# Altium project Smart Dimmer.PrjPcb
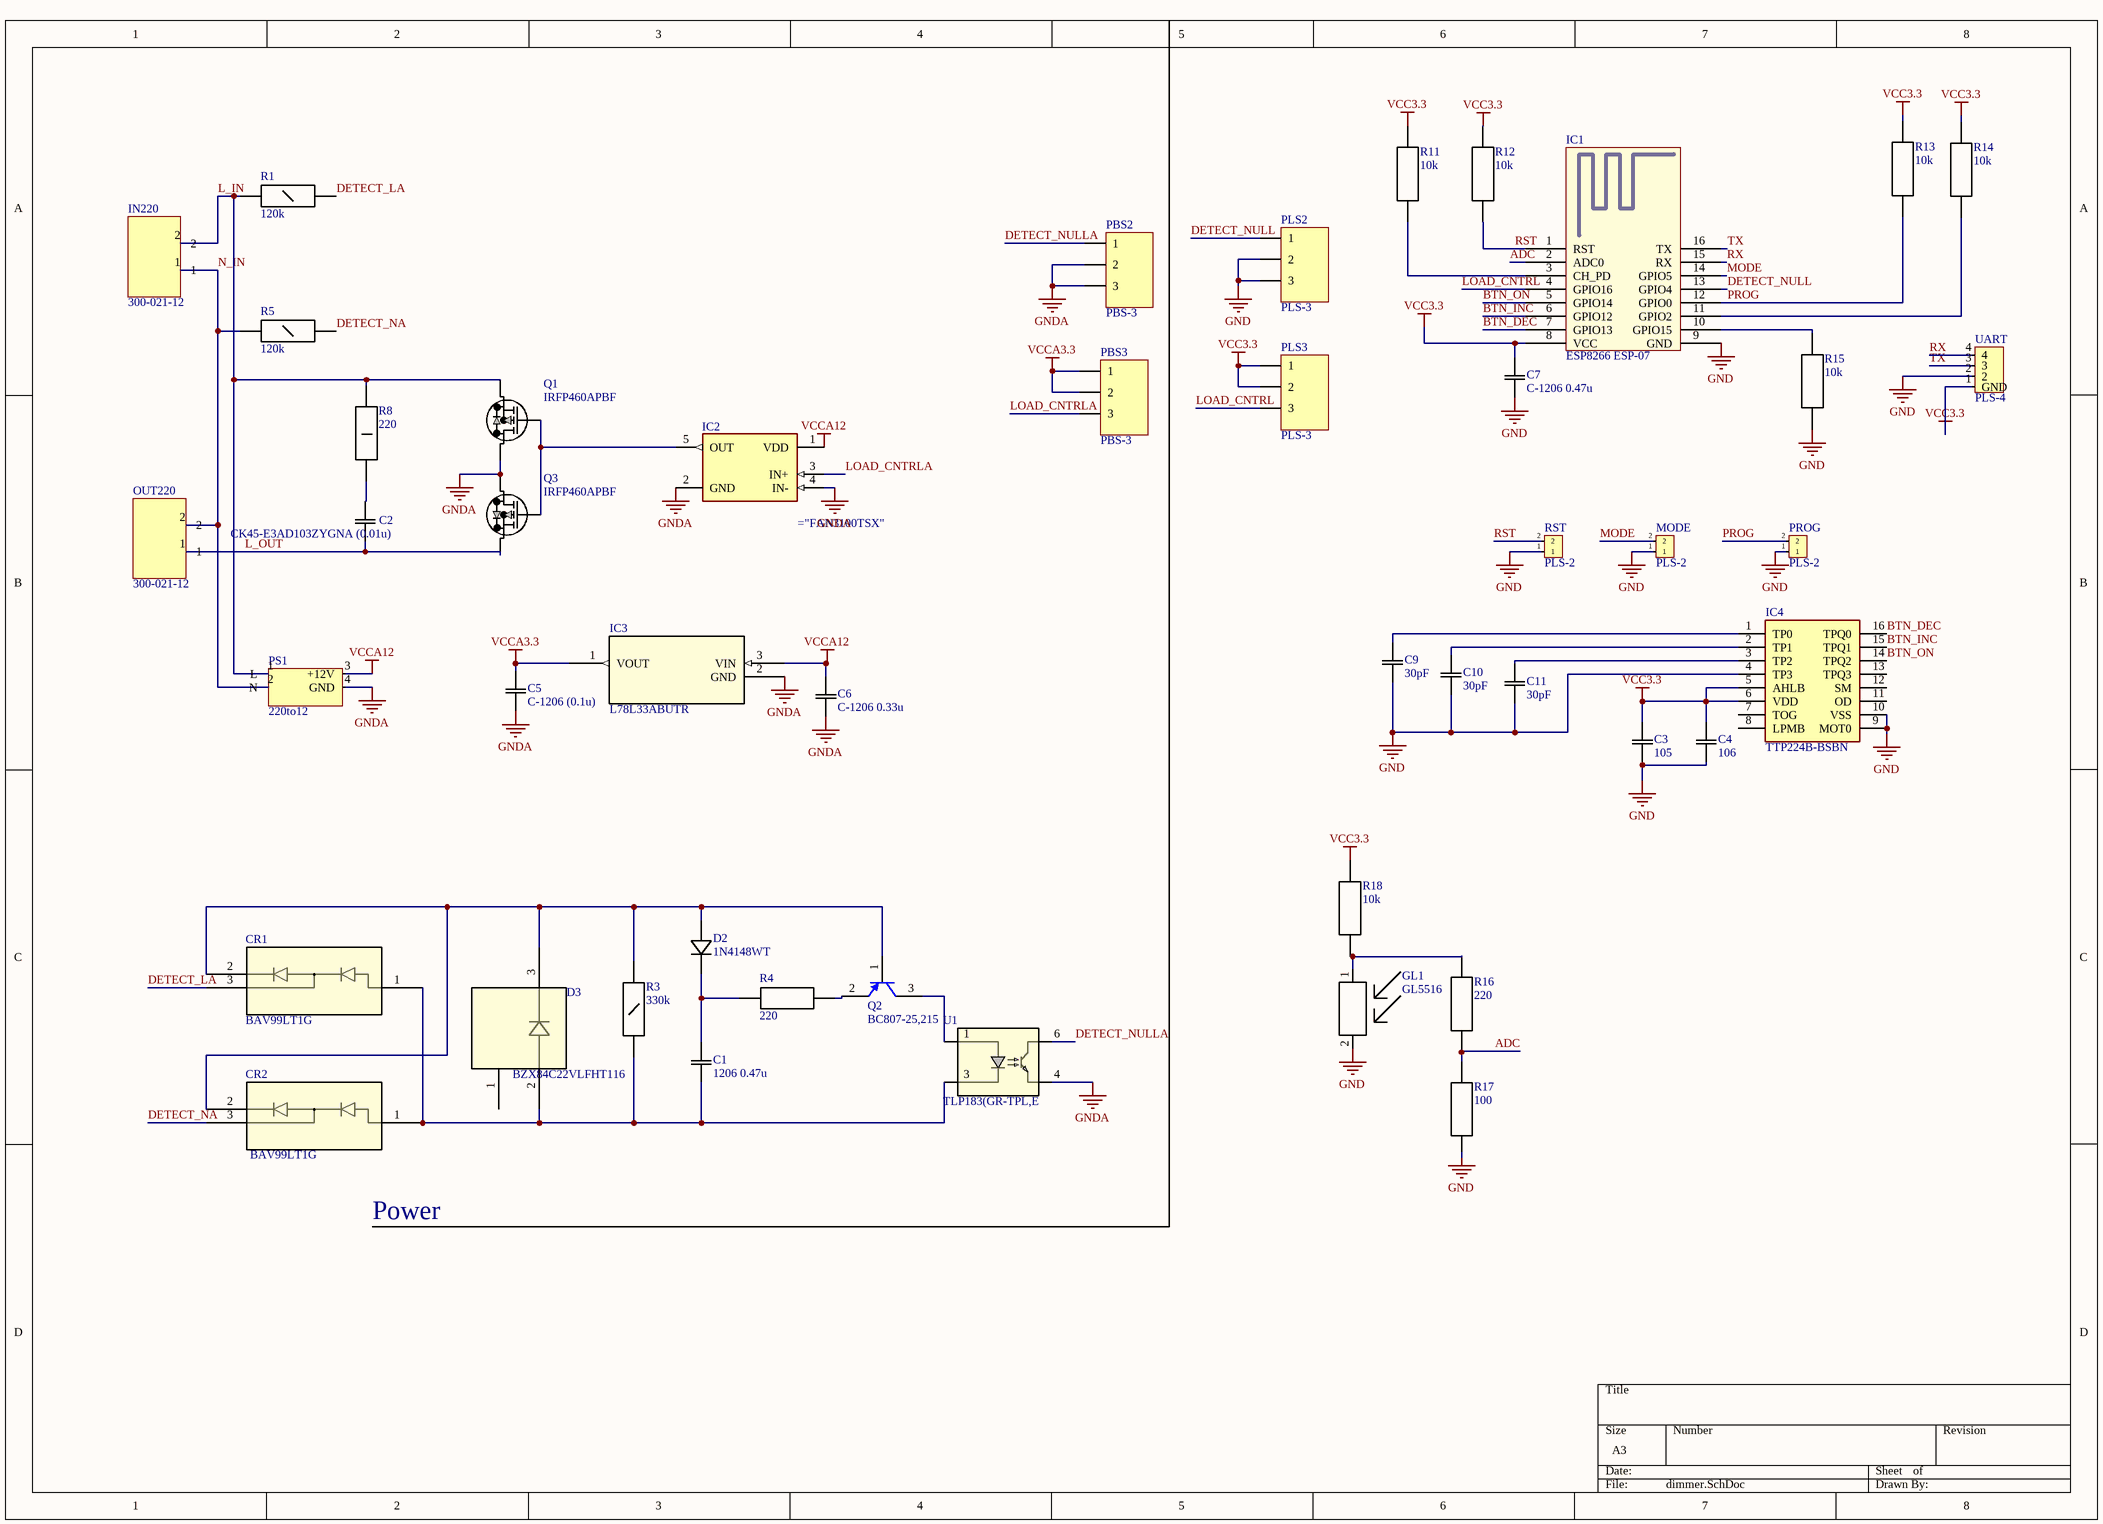
[diagram p0: dimmer.SchDoc]
1 sheet, 47 parts. Net scope: global (net labels, ports and power ports of the same name join across sheets).
Board files: PCB12_sensor.PcbDoc, PCB9.PcbDoc, PCB5.PcbDoc, PCB11_sensor.PcbDoc

## Sheet dimmer.SchDoc
size A3

### Parts
C1  1206 0.47u  [CAP_X7R_1206_AVX]
C2  CK45-E3AD103ZYGNA (0.01u)  [CAP_CK45E3103_TDK]
C3  105  [G-21_MUR]
C4  106  [G-21_MUR]
C5  C-1206 (0.1u)  [CAP_X7R_1206_AVX]
C6  C-1206 0.33u  [CAP_X7R_1206_AVX]
C7  C-1206 0.47u  [CAP_X7R_1206_AVX]
C9  30pF  [G-21_MUR]
C10  30pF  [G-21_MUR]
C11  30pF  [G-21_MUR]
CR1  BAV99LT1G  [SOT-23_TO-236_318-08_ONS]
CR2  BAV99LT1G  [SOT-23_TO-236_318-08_ONS]
D2  1N4148WT  [CR_SOD-523F_ONS]
D3  BZX84C22VLFHT116  [TRANS_BZX84_ROM]
GL1  GL5516  [GL5516]
IC1  ESP8266 ESP-07  [ESP8266 ESP-07]
IC2  FAN3100TSX  [ON_Semi_527AH_0]  (value not drawn)
IC3  L78L33ABUTR  [SOT-89_STM]
IC4  TTP224B-BSBN  [SOP64P600X175-16N]
IN220  300-021-12  [300-021-12]
MODE  PLS-2  [PLS-2]
OUT220  300-021-12  [300-021-12]
PBS2  PBS-3  [PBS-3]
PBS3  PBS-3  [PBS-3]
PLS2  PLS-3  [PLS-3]
PLS3  PLS-3  [PLS-3]
PROG  PLS-2  [PLS-2]
PS1  220to12  [220to12]
Q1  IRFP460APBF  [TO-247AC_VIS]
Q2  BC807-25,215  [SOT23_BC807_NEX]
Q3  IRFP460APBF  [TO-247AC_VIS]
R1  120k  [CAP_X7R_1206_AVX]
R3  330k  [CAP_X7R_1206_AVX]
R4  220  [G-21_MUR]
R5  120k  [CAP_X7R_1206_AVX]
R8  220  [RES2512_TL_TYCO_TYC]
R11  10k  [G-21_MUR]
R12  10k  [G-21_MUR]
R13  10k  [G-21_MUR]
R14  10k  [G-21_MUR]
R15  10k  [G-21_MUR]
R16  220  [G-21_MUR]
R17  100  [G-21_MUR]
R18  10k  [G-21_MUR]
RST  PLS-2  [PLS-2]
U1  TLP183(GR-TPL,E  [4pin SO6_TOS]
UART  PLS-4  [PLS-4]

### Nets
GND: C3.1 C4.1 C7.1 C9.1 C10.1 C11.1 GL1.2 IC1.9(GND) IC4.4(TP3) IC4.9(MOT0) IC4.10(VSS) MODE.1 PLS2.2 PLS2.3 PROG.1 R15.1 R17.1 RST.1 UART.2
GNDA: C5.1 C6.1 IC2.2(GND) IC2.4(IN-) IC3.2(GND) PBS2.2 PBS2.3 PS1.4(GND) Q1.2(D) Q3.2(D) U1.4
VCC3.3: C3.2 C4.2 C7.2 IC1.8(VCC) IC4.5(AHLB) IC4.6(VDD) PLS3.1 PLS3.2 R11.2 R12.2 R13.2 R14.2 R18.2 UART.1(GND)
VCCA3.3: C5.2 IC3.1(VOUT) PBS3.1 PBS3.2
VCCA12: C6.2 IC2.1(VDD) IC3.3(VIN) PS1.3(+12V)
ADC: IC1.2(ADC0) R16.1 R17.2
BTN_DEC: IC1.7(GPIO13) IC4.16(TPQ0)
BTN_INC: IC1.6(GPIO12) IC4.15(TPQ1)
BTN_ON: IC1.5(GPIO14) IC4.14(TPQ2)
DETECT_LA: CR1.3 R1.2
DETECT_NA: CR2.3 R5.2
DETECT_NULL: IC1.13(GPIO4) PLS2.1
DETECT_NULLA: PBS2.1 U1.6
L_IN: IN220.2 PS1.1(L) Q1.3(S) R1.1 R8.2
L_OUT: C2.1 OUT220.1 Q3.3(S)
LOAD_CNTRL: IC1.4(GPIO16) PLS3.3
LOAD_CNTRLA: IC2.3(IN+) PBS3.3
MODE: IC1.14(GPIO5) MODE.2
N_IN: IN220.1 OUT220.2 PS1.2(N) R5.1
PROG: IC1.12(GPIO0) PROG.2 R13.1
RST: IC1.1(RST) R12.1 RST.2
RX: IC1.15(RX) UART.4
TX: IC1.16(TX) UART.3
NetC1_1: C1.1 CR1.1 CR2.1 D3.2 R3.1 U1.3
NetC1_2: C1.2 D2.1 R4.1
NetC2_2: C2.2 R8.1
NetC9_2: C9.2 IC4.1(TP0)
NetC10_2: C10.2 IC4.2(TP1)
NetC11_2: C11.2 IC4.3(TP2)
NetCR1_2: CR1.2 CR2.2 D2.2 D3.3 Q2.1(B) R3.2
NetGL1_1: GL1.1 R16.2 R18.1
NetIC1_3: IC1.3(CH_PD) R11.1
NetIC1_10: IC1.10(GPIO15) R15.2
NetIC1_11: IC1.11(GPIO2) R14.1
NetIC2_5: IC2.5(OUT) Q1.1(G) Q3.1(G)
NetQ2_2: Q2.2 R4.2
NetQ2_3: Q2.3(C) U1.1

Not connected (* = marked no-connect by the designer): D3 1(2); IC4 7(TOG) 8(LPMB) 11(OD) 12(SM) 13(TPQ3)

### Notes on the sheet
- Power

### Library data of the parts
C1 C5-C7 = C-1206: No Description Available; Manufacturer_Part_Number: 12061C104KAT2A; Vendor: AVX Corporation; Built_By: EMA_UL_Team; SourceLibrary: AVX_2012-08-08; Type: DEV; Copyright: Copyright (C) 2018 Accelerated Designs. All rights reserved; RefDes: RefDes
C2 = CK45-E3AD103ZYGNA: No Description Available; Built_By: EMA_Matt; Vendor: TDK; SourceLibrary: TDK_2019-10-09; Type: DEV; Copyright: Copyright (C) 2018 Accelerated Designs. All rights reserved; Manufacturer_Part_Number: CK45-E3AD103ZYGNA; RefDes: RefDes
C3 C4 C9-C11 = cap0805: Manufacturer_Part_Number: GRM21BR71H224KA01L; Vendor: Murata; SourceLibrary: Murata_2014-12-31; Type: DEV; Copyright: Copyright (C) 2015 Accelerated Designs. All rights reserved; RefDes: RefDes
CR1 CR2 = BAV99LT1G: No Description Available; Vendor: ON Semiconductor; Built_By: EMA_Cory; SourceLibrary: ON_Semiconductor_2020-05-27; Type: DEV; Datasheet: https://www.onsemi.com/pub/Collateral/BAV99LT1-D.PDF; Manufacturer_Part_Number: BAV99LT1G; Copyright: Copyright (C) 2018 Accelerated Designs. All rights reserved; RefDes: RefDes
D2 = 1N4148WT: No Description Available; Vendor: ON Semiconductor; Built_By: EMA_Cory; SourceLibrary: ON_Semiconductor_2020-03-23; Type: DEV; Datasheet: https://www.onsemi.com/pub/Collateral/1N914BWT-D.pdf; Manufacturer_Part_Number: 1N4148WT; Copyright: Copyright (C) 2018 Accelerated Designs. All rights reserved; RefDes: RefDes
D3 = BZX84C22VLFHT116: No Description Available; Vendor: ROHM Semiconductor; Built_By: EMA_Matt; SourceLibrary: Rohm_2019-09-23; Type: DEV; Manufacturer_Part_Number: BZX84C22VLFHT116; Copyright: Copyright (C) 2018 Accelerated Designs. All rights reserved; RefDes: RefDes
IC3 = L78L33ABUTR: No Description Available; SourceLibrary: StMicro_2011-06-07; Built_By: EMA_UL_Team; Vendor: STMicroelectronics; Manufacturer_Part_Number: L78L33ABUTR; Copyright: Copyright (C) 2018 Accelerated Designs. All rights reserved; RefDes: RefDes; Type: DEV
IC4 = TTP224B-BSBN: Integrated Circuit; Manufacturer_Name: TONTEK; Datasheet Link: https://datasheet.lcsc.com/szlcsc/Tontek-Design-Tech-TTP224B-BSBN_C94149.pdf; Height: 1.75mm; Manufacturer_Part_Number: TTP224B-BSBN
Q1 Q3 = IRFP460APBF: No Description Available; Vendor: Vishay; Built_By: EMA_UL_Team; SourceLibrary: Vishay_2020-02-10; Type: DEV; Manufacturer_Part_Number: IRFP460APBF; Copyright: Copyright (C) 2018 Accelerated Designs. All rights reserved; RefDes: RefDes
Q2 = BC807-25,215: No Description Available; Built_By: EMA_Justin; Vendor: Nexperia; SourceLibrary: Nexperia_2018-12-15; Type: DEV; Copyright: Copyright (C) 2016 Accelerated Designs. All rights reserved; Manufacturer_Part_Number: BC807-25,215; RefDes: RefDes
R1 R3 R5 = R-1206
R4 R11-R18 = res0805: Resistor 0805
R8 = R-2512: No Description Available; Manufacturer_Part_Number: TL3AR033F; Vendor: TE Connectivity; Built_By: EMA_UL_Team; SourceLibrary: Tyco_2012-01-31a; Copyright: Copyright (C) 2018 Accelerated Designs. All rights reserved; RefDes: RefDes; Type: DEV
U1 = TLP183(GR-TPL,E: No Description Available; Vendor: Toshiba; Built_By: EMA_UL_Team; SourceLibrary: Toshiba_2019-12-10; Number_devices_in_Package: 1; Manufacturer_Part_Number: TLP183(GR-TPL,E; Copyright: Copyright (C) 2018 Accelerated Designs. All rights reserved; RefDes: RefDes; Type: DEV; Source_Package: TLP183